# Altium schematic sheet TopSheet.SchDoc
size B; Address1: MILWAUKEE TOOL; Address2: 13135 W. Lisbon Rd.; Address3: Brookfield, WI 53005; SheetNumber: 1; SheetTotal: 1
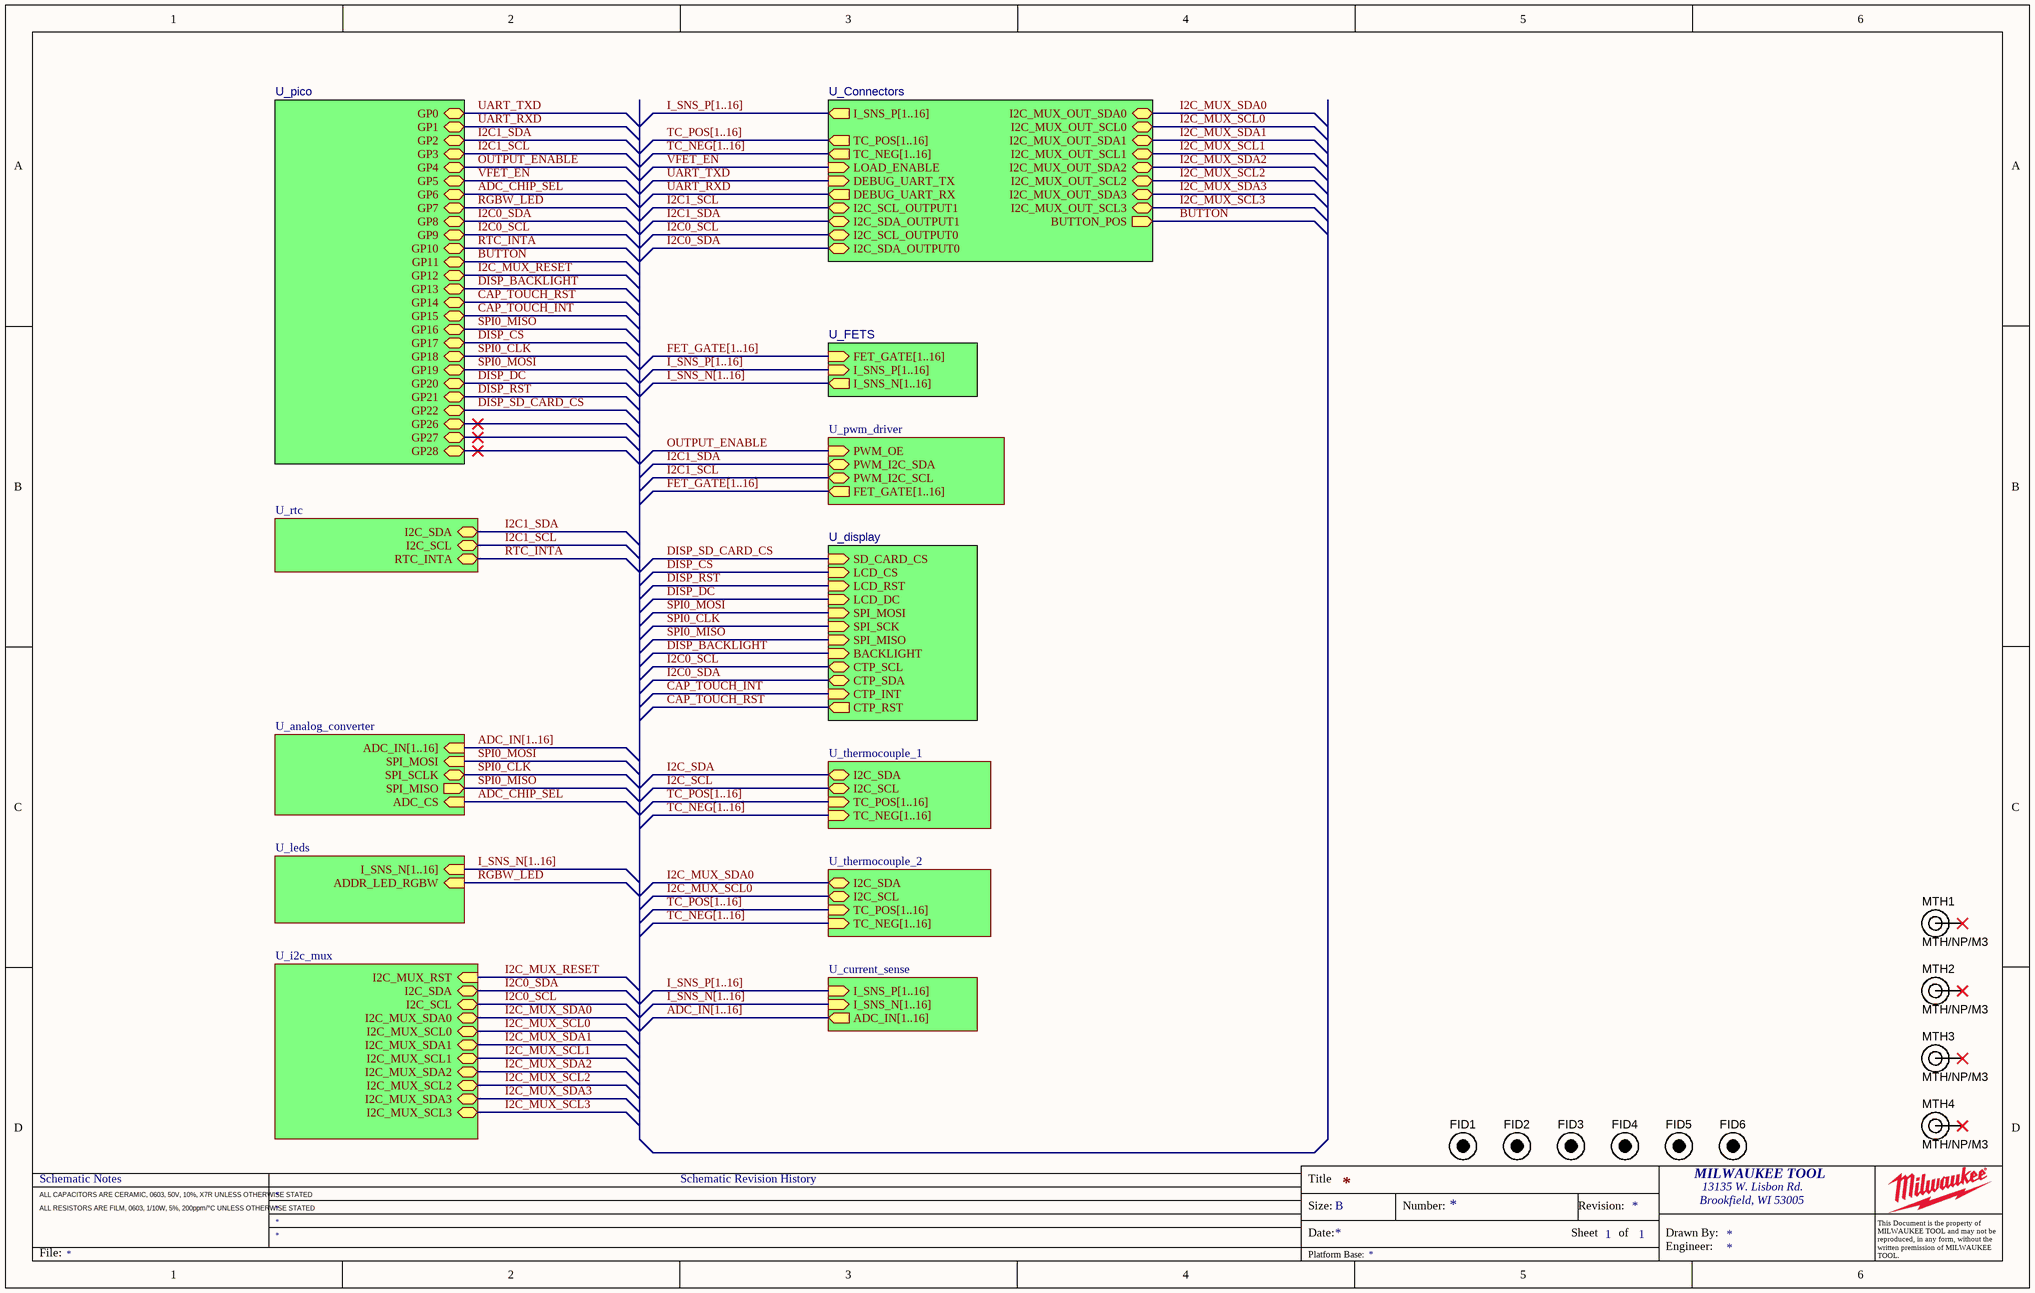
[diagram p0: TopSheet.SchDoc]

## Parts
FID1  FIDUCIAL STANDARD  [FID]  (value not drawn)  (no BOM)
FID2  FIDUCIAL STANDARD  [FID]  (value not drawn)  (no BOM)
FID3  FIDUCIAL STANDARD  [FID]  (value not drawn)  (no BOM)
FID4  FIDUCIAL STANDARD  [FID]  (value not drawn)  (no BOM)
FID5  FIDUCIAL STANDARD  [FID]  (value not drawn)  (no BOM)
FID6  FIDUCIAL STANDARD  [FID]  (value not drawn)  (no BOM)
MTH1  MTH/NP/M3  [MTGNP700H325Z700P]  (no BOM)
MTH2  MTH/NP/M3  [MTGNP700H325Z700P]  (no BOM)
MTH3  MTH/NP/M3  [MTGNP700H325Z700P]  (no BOM)
MTH4  MTH/NP/M3  [MTGNP700H325Z700P]  (no BOM)

## Sub-sheets
U_analog_converter = analog_converter.SchDoc: ADC_IN[1..16] (in), SPI_MISO (out), SPI_MOSI (in), SPI_SCLK (bidir), ADC_CS (in)
U_Connectors = Connectors.SchDoc: DEBUG_UART_TX (in), DEBUG_UART_RX (out), I2C_SCL_OUTPUT1 (bidir), I2C_SDA_OUTPUT1 (bidir), LOAD_ENABLE (in), I_SNS_P[1..16] (out), TC_POS[1..16] (out), TC_NEG[1..16] (out), I2C_MUX_OUT_SDA0 (bidir), I2C_MUX_OUT_SCL0 (bidir), I2C_MUX_OUT_SDA1 (bidir), I2C_MUX_OUT_SCL1 (bidir), I2C_MUX_OUT_SDA2 (bidir), I2C_MUX_OUT_SCL2 (bidir), I2C_MUX_OUT_SDA3 (bidir), I2C_MUX_OUT_SCL3 (bidir), BUTTON_POS (out), I2C_SDA_OUTPUT0 (bidir), I2C_SCL_OUTPUT0 (bidir)
U_current_sense = current_sense.SchDoc: ADC_IN[1..16] (out), I_SNS_P[1..16] (in), I_SNS_N[1..16] (in)
U_display = display.SchDoc: LCD_CS (in), LCD_RST (in), LCD_DC (in), SPI_MOSI (in), SPI_SCK (in), BACKLIGHT (in), SPI_MISO (in), CTP_SCL (bidir), CTP_RST (out), CTP_SDA (bidir), CTP_INT (in), SD_CARD_CS (in)
U_FETS = FETS.SchDoc: FET_GATE[1..16] (in), I_SNS_N[1..16] (out), I_SNS_P[1..16] (in)
U_i2c_mux = i2c_mux.SchDoc: I2C_SDA (bidir), I2C_SCL (bidir), I2C_MUX_SDA0 (bidir), I2C_MUX_SDA1 (bidir), I2C_MUX_SDA2 (bidir), I2C_MUX_SDA3 (bidir), I2C_MUX_SCL0 (bidir), I2C_MUX_SCL1 (bidir), I2C_MUX_SCL2 (bidir), I2C_MUX_SCL3 (bidir), I2C_MUX_RST (in)
U_leds = leds.SchDoc: I_SNS_N[1..16] (in), ADDR_LED_RGBW (in)
U_pico = pico.SchDoc: GP0 (bidir), GP1 (bidir), GP2 (bidir), GP3 (bidir), GP4 (bidir), GP5 (bidir), GP6 (bidir), GP7 (bidir), GP8 (bidir), GP9 (bidir), GP10 (bidir), GP11 (bidir), GP12 (bidir), GP13 (bidir), GP14 (bidir), GP15 (bidir), GP16 (bidir), GP17 (bidir), GP18 (bidir), GP19 (bidir), GP20 (bidir), GP21 (bidir), GP22 (bidir), GP26 (bidir), GP27 (bidir), GP28 (bidir)
U_pwm_driver = pwm_driver.SchDoc: PWM_OE (in), PWM_I2C_SDA (bidir), PWM_I2C_SCL (bidir), FET_GATE[1..16] (out)
U_rtc = rtc.SchDoc: I2C_SDA (bidir), I2C_SCL (bidir), RTC_INTA (bidir)
U_thermocouple_1 = thermocouple_1.SchDoc: I2C_SDA (bidir), I2C_SCL (bidir), TC_POS[1..16] (in), TC_NEG[1..16] (in)
U_thermocouple_2 = thermocouple_2.SchDoc: I2C_SDA (bidir), I2C_SCL (bidir), TC_POS[1..16] (in), TC_NEG[1..16] (in)

## Nets
ADC_CHIP_SEL: sheet U_pico/GP6, sheet U_analog_converter/ADC_CS
BUTTON: sheet U_pico/GP11, sheet U_Connectors/BUTTON_POS
CAP_TOUCH_INT: sheet U_pico/GP15, sheet U_display/CTP_INT
CAP_TOUCH_RST: sheet U_pico/GP14, sheet U_display/CTP_RST
DISP_BACKLIGHT: sheet U_pico/GP13, sheet U_display/BACKLIGHT
DISP_CS: sheet U_pico/GP17, sheet U_display/LCD_CS
DISP_DC: sheet U_pico/GP20, sheet U_display/LCD_DC
DISP_RST: sheet U_pico/GP21, sheet U_display/LCD_RST
DISP_SD_CARD_CS: sheet U_pico/GP22, sheet U_display/SD_CARD_CS
I2C0_SCL: sheet U_pico/GP9, sheet U_Connectors/I2C_SCL_OUTPUT0, sheet U_i2c_mux/I2C_SCL, sheet U_display/CTP_SCL
I2C0_SDA: sheet U_pico/GP8, sheet U_Connectors/I2C_SDA_OUTPUT0, sheet U_i2c_mux/I2C_SDA, sheet U_display/CTP_SDA
I2C1_SCL: sheet U_pico/GP3, sheet U_Connectors/I2C_SCL_OUTPUT1, sheet U_pwm_driver/PWM_I2C_SCL, sheet U_rtc/I2C_SCL
I2C1_SDA: sheet U_pico/GP2, sheet U_Connectors/I2C_SDA_OUTPUT1, sheet U_pwm_driver/PWM_I2C_SDA, sheet U_rtc/I2C_SDA
I2C_MUX_RESET: sheet U_pico/GP12, sheet U_i2c_mux/I2C_MUX_RST
I2C_MUX_SCL0: sheet U_Connectors/I2C_MUX_OUT_SCL0, sheet U_i2c_mux/I2C_MUX_SCL0, sheet U_thermocouple_2/I2C_SCL
I2C_MUX_SCL1: sheet U_Connectors/I2C_MUX_OUT_SCL1, sheet U_i2c_mux/I2C_MUX_SCL1
I2C_MUX_SCL2: sheet U_Connectors/I2C_MUX_OUT_SCL2, sheet U_i2c_mux/I2C_MUX_SCL2
I2C_MUX_SCL3: sheet U_Connectors/I2C_MUX_OUT_SCL3, sheet U_i2c_mux/I2C_MUX_SCL3
I2C_MUX_SDA0: sheet U_Connectors/I2C_MUX_OUT_SDA0, sheet U_i2c_mux/I2C_MUX_SDA0, sheet U_thermocouple_2/I2C_SDA
I2C_MUX_SDA1: sheet U_Connectors/I2C_MUX_OUT_SDA1, sheet U_i2c_mux/I2C_MUX_SDA1
I2C_MUX_SDA2: sheet U_Connectors/I2C_MUX_OUT_SDA2, sheet U_i2c_mux/I2C_MUX_SDA2
I2C_MUX_SDA3: sheet U_Connectors/I2C_MUX_OUT_SDA3, sheet U_i2c_mux/I2C_MUX_SDA3
I2C_SCL: sheet U_thermocouple_1/I2C_SCL
I2C_SDA: sheet U_thermocouple_1/I2C_SDA
OUTPUT_ENABLE: sheet U_pico/GP4, sheet U_pwm_driver/PWM_OE
RGBW_LED: sheet U_pico/GP7, sheet U_leds/ADDR_LED_RGBW
RTC_INTA: sheet U_pico/GP10, sheet U_rtc/RTC_INTA
SPI0_CLK: sheet U_pico/GP18, sheet U_analog_converter/SPI_SCLK, sheet U_display/SPI_SCK
SPI0_MISO: sheet U_pico/GP16, sheet U_analog_converter/SPI_MISO, sheet U_display/SPI_MISO
SPI0_MOSI: sheet U_pico/GP19, sheet U_analog_converter/SPI_MOSI, sheet U_display/SPI_MOSI
UART_RXD: sheet U_pico/GP1, sheet U_Connectors/DEBUG_UART_RX
UART_TXD: sheet U_pico/GP0, sheet U_Connectors/DEBUG_UART_TX
VFET_EN: sheet U_pico/GP5, sheet U_Connectors/LOAD_ENABLE

Not connected (* = marked no-connect by the designer): MTH1 1*; MTH2 1*; MTH3 1*; MTH4 1*

## Buses and harness runs
bus ADC_IN[1..16] = sheet U_analog_converter/ADC_IN[1..16]
bus ADC_IN[1..16] = sheet U_current_sense/ADC_IN[1..16]
bus FET_GATE[1..16] = sheet U_FETS/FET_GATE[1..16]
bus FET_GATE[1..16] = sheet U_pwm_driver/FET_GATE[1..16]
bus I_SNS_N[1..16] = sheet U_current_sense/I_SNS_N[1..16]
bus I_SNS_N[1..16] = sheet U_FETS/I_SNS_N[1..16]
bus I_SNS_N[1..16] = sheet U_leds/I_SNS_N[1..16]
bus I_SNS_P[1..16] = sheet U_Connectors/I_SNS_P[1..16]
bus I_SNS_P[1..16] = sheet U_current_sense/I_SNS_P[1..16]
bus I_SNS_P[1..16] = sheet U_FETS/I_SNS_P[1..16]
bus TC_NEG[1..16] = sheet U_Connectors/TC_NEG[1..16]
bus TC_NEG[1..16] = sheet U_thermocouple_1/TC_NEG[1..16]
bus TC_NEG[1..16] = sheet U_thermocouple_2/TC_NEG[1..16]
bus TC_POS[1..16] = sheet U_Connectors/TC_POS[1..16]
bus TC_POS[1..16] = sheet U_thermocouple_1/TC_POS[1..16]
bus TC_POS[1..16] = sheet U_thermocouple_2/TC_POS[1..16]

## Notes on the sheet
- Schematic Notes
- Schematic Revision History
- Title
- ALL CAPACITORS ARE CERAMIC, 0603, 50V, 10%, X7R UNLESS OTHERWISE STATED
- ALL RESISTORS ARE FILM, 0603, 1/10W, 5%, 200ppm/°C UNLESS OTHERWISE STATED
- Size:
- Date:
- B
- Number:
- Sheet
- Revision:
- of
- Drawn By:
- Brookfield, WI 53005
- File:
- Platform Base:
- Engineer:
- This Document is the property of MILWAUKEE TOOL and may not be reproduced, in any form, without the written premission of MILWAUKEE TOOL.

## Library data of the parts
FID1-FID6 = CMP-019-0003: STANDARD PCB FIDUCIAL; Populate: DNP; Soldermask Dimensions: 1.3mm; Copper Dimensions: 1mm; Design Item ID: Fiducial, Standard
MTH1-MTH4 = CMP-022-0003: M3 Screw Mounted Hole Non-Plated; Drill size: 3.25mm; Annular Ring Size: 7mm; Bolt Diameter: 3mm; Populate: DNP; Bolt Head Size: 6.3mm; Design Item ID: MTH/NP/M3; ClassName: MTHole